# Altium schematic sheet digital_socket.SchDoc
size 250 x 190 mm; SheetNumber: 6; SheetTotal: 13
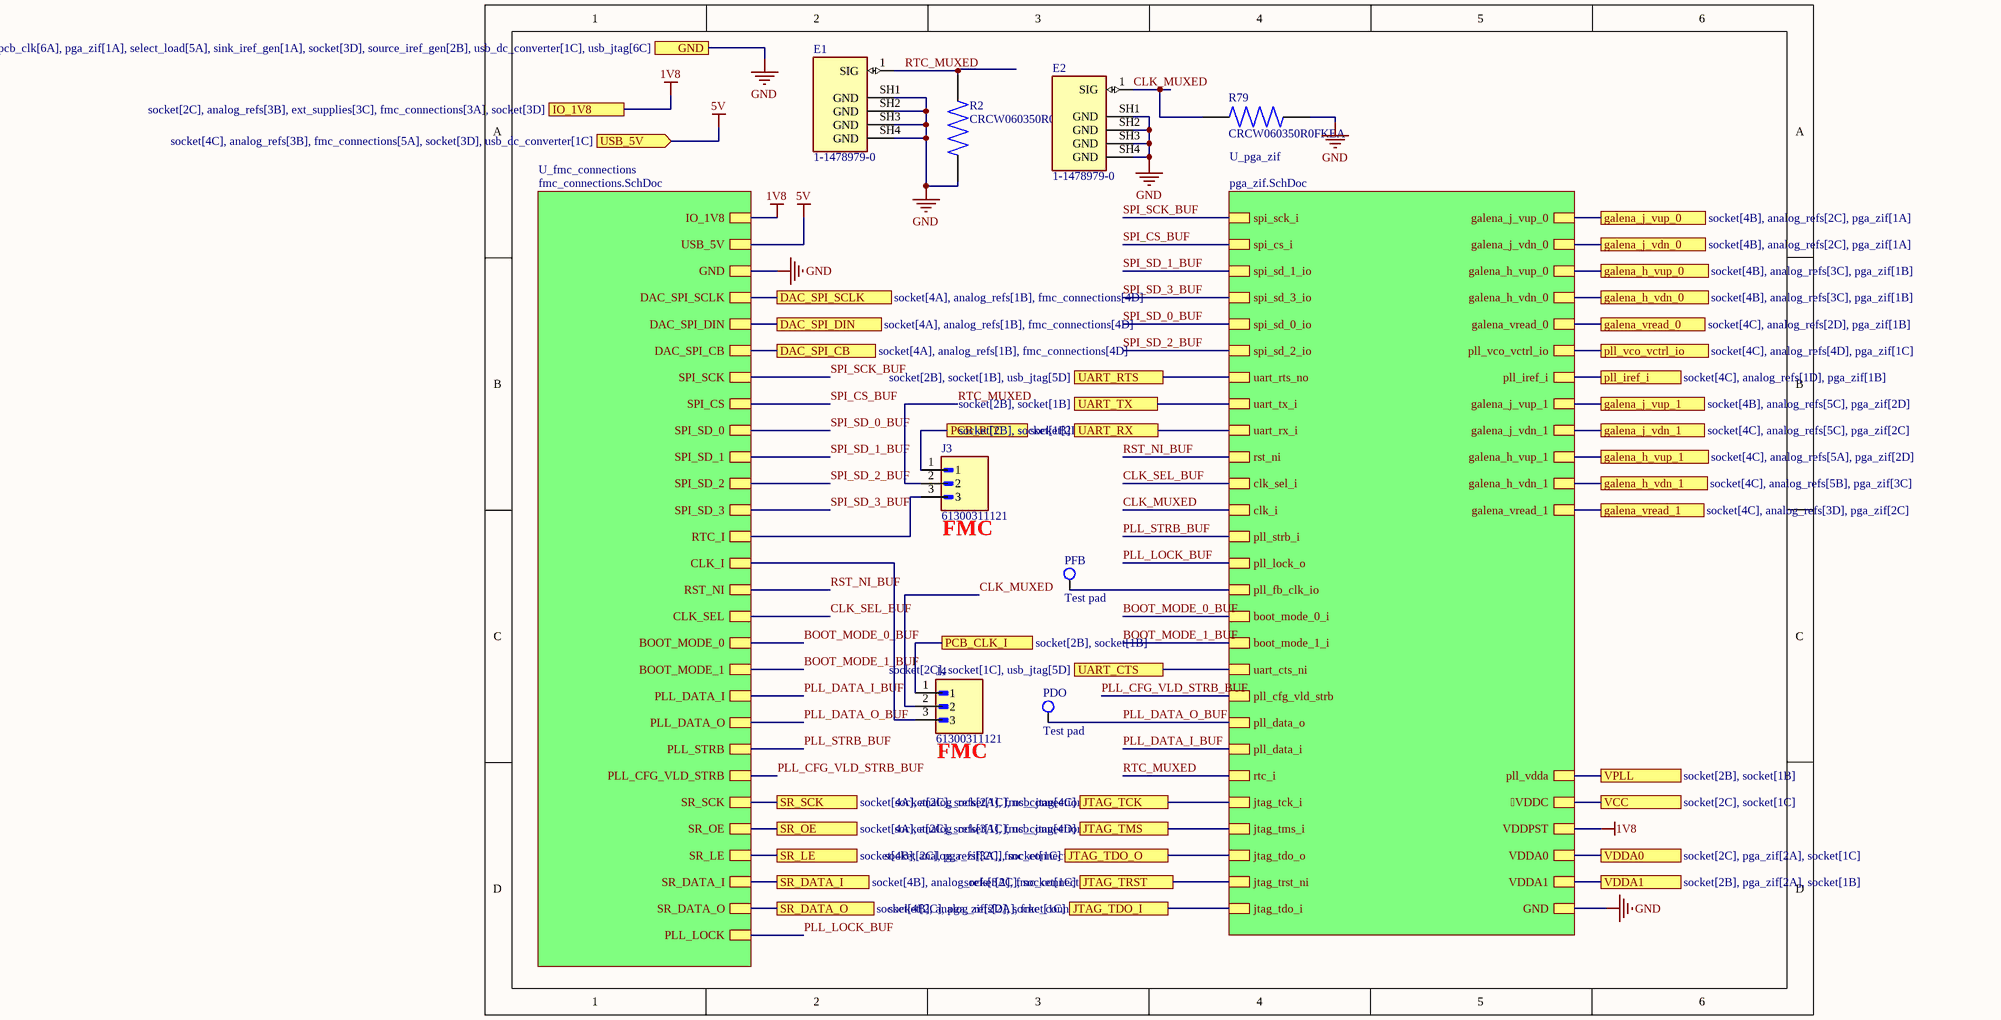
[diagram p0: digital_socket.SchDoc]

## Parts
E1  1-1478979-0  [TE_1-1478979-0]
E2  1-1478979-0  [TE_1-1478979-0]
J3  61300311121  [WURTH_61300311121]
J4  61300311121  [WURTH_61300311121]
PDO  Test pad  [Test Pad]
PFB  Test pad  [Test Pad]
R2  CRCW060350R0FKEA  [RESC1508X50N]
R79  CRCW060350R0FKEA  [RESC1508X50N]

## Sub-sheets
U_fmc_connections = fmc_connections.SchDoc: IO_1V8, USB_5V, GND, DAC_SPI_SCLK, DAC_SPI_DIN, DAC_SPI_CB, SPI_SCK, SPI_CS, SPI_SD_0, SPI_SD_1, SPI_SD_2, SPI_SD_3, RTC_I, CLK_I, RST_NI, CLK_SEL, BOOT_MODE_0, BOOT_MODE_1, PLL_DATA_I, PLL_DATA_O, PLL_STRB, PLL_CFG_VLD_STRB, SR_SCK, SR_OE, SR_LE, SR_DATA_I, SR_DATA_O, PLL_LOCK
U_pga_zif = pga_zif.SchDoc: GND, VDDC, VDDPST, VDDA0, VDDA1, galena_j_vup_0, galena_j_vdn_0, spi_sck_i, spi_cs_i, spi_sd_1_io, spi_sd_3_io, galena_h_vup_0, galena_h_vdn_0, spi_sd_0_io, spi_sd_2_io, uart_rts_no, pll_iref_i, galena_vread_0, uart_tx_i, uart_rx_i, rst_ni, clk_sel_i, clk_i, pll_vco_vctrl_io, pll_strb_i, pll_lock_o, pll_fb_clk_io, boot_mode_0_i, boot_mode_1_i, uart_cts_ni, pll_cfg_vld_strb, pll_data_o, pll_data_i, galena_h_vdn_1, rtc_i, jtag_tck_i, jtag_tms_i, jtag_tdo_o, galena_vread_1, galena_j_vdn_1, jtag_trst_ni, jtag_tdo_i, galena_j_vup_1, galena_h_vup_1, pll_vdda

## Ports
DAC_SPI_CB (see socket[4A], analog_refs[1B], fmc_connections[4D]), DAC_SPI_DIN (see socket[4A], analog_refs[1B], fmc_connections[4D]), DAC_SPI_SCLK (see socket[4A], analog_refs[1B], fmc_connections[4D]), galena_h_vdn_0 (see socket[4B], analog_refs[3C], pga_zif[1B]), galena_h_vdn_1 (see socket[4C], analog_refs[5B], pga_zif[3C]), galena_h_vup_0 (see socket[4B], analog_refs[3C], pga_zif[1B]), galena_h_vup_1 (see socket[4C], analog_refs[5A], pga_zif[2D]), galena_j_vdn_0 (see socket[4B], analog_refs[2C], pga_zif[1A]), galena_j_vdn_1 (see socket[4C], analog_refs[5C], pga_zif[2C]), galena_j_vup_0 (see socket[4B], analog_refs[2C], pga_zif[1A]), galena_j_vup_1 (see socket[4B], analog_refs[5C], pga_zif[2D]), galena_vread_0 (see socket[4C], analog_refs[2D], pga_zif[1B]), galena_vread_1 (see socket[4C], analog_refs[3D], pga_zif[2C]), GND (see socket[4C], analog_refs[3B], fmc_connections[6A], pcb_clk[6A], pga_zif[1A], select_load[5A], sink_iref_gen[1A], socket[3D], source_iref_gen[2B], usb_dc_converter[1C], usb_jtag[6C]), IO_1V8 (see socket[2C], analog_refs[3B], ext_supplies[3C], fmc_connections[3A], socket[3D]), JTAG_TCK (see socket[2C], socket[1C], usb_jtag[4C]), JTAG_TDO_I (see socket[2C], pga_zif[2D], socket[1C]), JTAG_TDO_O (see socket[2C], pga_zif[2C], socket[1C]), JTAG_TMS (see socket[2C], socket[1C], usb_jtag[4D]), JTAG_TRST (see socket[2C], socket[1C]), PCB_CLK_I (see socket[2B], socket[1B]), PCB_RTC (see socket[2B], socket[1B]), pll_iref_i (see socket[4C], analog_refs[1D], pga_zif[1B]), pll_vco_vctrl_io (see socket[4C], analog_refs[4D], pga_zif[1C]), SR_DATA_I (see socket[4B], analog_refs[3A], fmc_connections[6C]), SR_DATA_O (see socket[4B], analog_refs[2A], fmc_connections[5D]), SR_LE (see socket[4B], analog_refs[3A], fmc_connections[6C]), SR_OE (see socket[4A], analog_refs[3A], fmc_connections[6C]), SR_SCK (see socket[4A], analog_refs[2A], fmc_connections[6C]), UART_CTS (see socket[2C], socket[1C], usb_jtag[5D]), UART_RTS (see socket[2B], socket[1B], usb_jtag[5D]), UART_RX (see socket[2B], socket[1B]), UART_TX (see socket[2B], socket[1B]), USB_5V (in, see socket[4C], analog_refs[3B], fmc_connections[5A], socket[3D], usb_dc_converter[1C]), VCC (see socket[2C], socket[1C]), VDDA0 (see socket[2C], pga_zif[2A], socket[1C]), VDDA1 (see socket[2B], pga_zif[2A], socket[1B]), VPLL (see socket[2B], socket[1B])

## Nets
1V8: port IO_1V8, sheet U_fmc_connections/IO_1V8, sheet U_pga_zif/VDDPST
5V: port USB_5V, sheet U_fmc_connections/USB_5V
GND: E1.SH1(GND) E1.SH2(GND) E1.SH3(GND) E1.SH4(GND) E2.SH1(GND) E2.SH2(GND) E2.SH3(GND) E2.SH4(GND) R2.1 R79.2 ; port GND, sheet U_fmc_connections/GND, sheet U_pga_zif/GND
BOOT_MODE_0_BUF: sheet U_fmc_connections/BOOT_MODE_0, sheet U_pga_zif/boot_mode_0_i
BOOT_MODE_1_BUF: sheet U_fmc_connections/BOOT_MODE_1, sheet U_pga_zif/boot_mode_1_i
CLK_MUXED: E2.1(SIG) J4.2 R79.1 ; sheet U_pga_zif/clk_i
CLK_SEL_BUF: sheet U_fmc_connections/CLK_SEL, sheet U_pga_zif/clk_sel_i
DAC_SPI_CB: port DAC_SPI_CB, sheet U_fmc_connections/DAC_SPI_CB
DAC_SPI_DIN: port DAC_SPI_DIN, sheet U_fmc_connections/DAC_SPI_DIN
DAC_SPI_SCLK: port DAC_SPI_SCLK, sheet U_fmc_connections/DAC_SPI_SCLK
galena_h_vdn_0: port galena_h_vdn_0, sheet U_pga_zif/galena_h_vdn_0
galena_h_vdn_1: port galena_h_vdn_1, sheet U_pga_zif/galena_h_vdn_1
galena_h_vup_0: port galena_h_vup_0, sheet U_pga_zif/galena_h_vup_0
galena_h_vup_1: port galena_h_vup_1, sheet U_pga_zif/galena_h_vup_1
galena_j_vdn_0: port galena_j_vdn_0, sheet U_pga_zif/galena_j_vdn_0
galena_j_vdn_1: port galena_j_vdn_1, sheet U_pga_zif/galena_j_vdn_1
galena_j_vup_0: port galena_j_vup_0, sheet U_pga_zif/galena_j_vup_0
galena_j_vup_1: port galena_j_vup_1, sheet U_pga_zif/galena_j_vup_1
galena_vread_0: port galena_vread_0, sheet U_pga_zif/galena_vread_0
galena_vread_1: port galena_vread_1, sheet U_pga_zif/galena_vread_1
JTAG_TCK: port JTAG_TCK, sheet U_pga_zif/jtag_tck_i
JTAG_TDO_I: port JTAG_TDO_I, sheet U_pga_zif/jtag_tdo_i
JTAG_TDO_O: port JTAG_TDO_O, sheet U_pga_zif/jtag_tdo_o
JTAG_TMS: port JTAG_TMS, sheet U_pga_zif/jtag_tms_i
JTAG_TRST: port JTAG_TRST, sheet U_pga_zif/jtag_trst_ni
PCB_CLK_I: J4.1 ; port PCB_CLK_I
PCB_RTC: J3.1 ; port PCB_RTC
PLL_CFG_VLD_STRB_BUF: sheet U_fmc_connections/PLL_CFG_VLD_STRB, sheet U_pga_zif/pll_cfg_vld_strb
PLL_DATA_I_BUF: sheet U_fmc_connections/PLL_DATA_I, sheet U_pga_zif/pll_data_i
PLL_DATA_O_BUF: PDO.1 ; sheet U_fmc_connections/PLL_DATA_O, sheet U_pga_zif/pll_data_o
pll_iref_i: port pll_iref_i, sheet U_pga_zif/pll_iref_i
PLL_LOCK_BUF: sheet U_fmc_connections/PLL_LOCK, sheet U_pga_zif/pll_lock_o
PLL_STRB_BUF: sheet U_fmc_connections/PLL_STRB, sheet U_pga_zif/pll_strb_i
pll_vco_vctrl_io: port pll_vco_vctrl_io, sheet U_pga_zif/pll_vco_vctrl_io
RST_NI_BUF: sheet U_fmc_connections/RST_NI, sheet U_pga_zif/rst_ni
RTC_MUXED: E1.1(SIG) J3.2 R2.2 ; sheet U_pga_zif/rtc_i
SPI_CS_BUF: sheet U_fmc_connections/SPI_CS, sheet U_pga_zif/spi_cs_i
SPI_SCK_BUF: sheet U_fmc_connections/SPI_SCK, sheet U_pga_zif/spi_sck_i
SPI_SD_0_BUF: sheet U_fmc_connections/SPI_SD_0, sheet U_pga_zif/spi_sd_0_io
SPI_SD_1_BUF: sheet U_fmc_connections/SPI_SD_1, sheet U_pga_zif/spi_sd_1_io
SPI_SD_2_BUF: sheet U_fmc_connections/SPI_SD_2, sheet U_pga_zif/spi_sd_2_io
SPI_SD_3_BUF: sheet U_fmc_connections/SPI_SD_3, sheet U_pga_zif/spi_sd_3_io
SR_DATA_I: port SR_DATA_I, sheet U_fmc_connections/SR_DATA_I
SR_DATA_O: port SR_DATA_O, sheet U_fmc_connections/SR_DATA_O
SR_LE: port SR_LE, sheet U_fmc_connections/SR_LE
SR_OE: port SR_OE, sheet U_fmc_connections/SR_OE
SR_SCK: port SR_SCK, sheet U_fmc_connections/SR_SCK
UART_CTS: port UART_CTS, sheet U_pga_zif/uart_cts_ni
UART_RTS: port UART_RTS, sheet U_pga_zif/uart_rts_no
UART_RX: port UART_RX, sheet U_pga_zif/uart_rx_i
UART_TX: port UART_TX, sheet U_pga_zif/uart_tx_i
VCC: port VCC, sheet U_pga_zif/VDDC
VDDA0: port VDDA0, sheet U_pga_zif/VDDA0
VDDA1: port VDDA1, sheet U_pga_zif/VDDA1
VPLL: port VPLL, sheet U_pga_zif/pll_vdda
NetJ3_3: J3.3 ; sheet U_fmc_connections/RTC_I
NetJ4_3: J4.3 ; sheet U_fmc_connections/CLK_I
NetPFB_1: PFB.1 ; sheet U_pga_zif/pll_fb_clk_io

## Notes on the sheet
- (near J3) FMC
- (near J4) FMC

## Library data of the parts
R2 R79 = CRCW060350R0FKEA: Resistor,Thick Film,50 Ohms,0.1 W,1%,SMT,0603,TCR 37 ppm/DegC,Cut Tape | Vishay Dale CRCW060350R0FKEA; MF: Vishay Intertechnology; SnapEDA_Link: https://www.snapeda.com/parts/CRCW060350R0FKEA/Vishay/view-part/?ref=snap; Package: Package; Value: *; MP: CRCW060350R0FKEA; Check_prices: https://www.snapeda.com/parts/CRCW060350R0FKEA/Vishay/view-part/?ref=eda
E1 E2 = 1-1478979-0: Package: None; Price: None; Value: *; MP: 1-1478979-0; Availability: Unavailable
J3 J4 = 61300311121: Package: None; Price: None; Value: *; MP: 61300311121; Availability: Unavailable